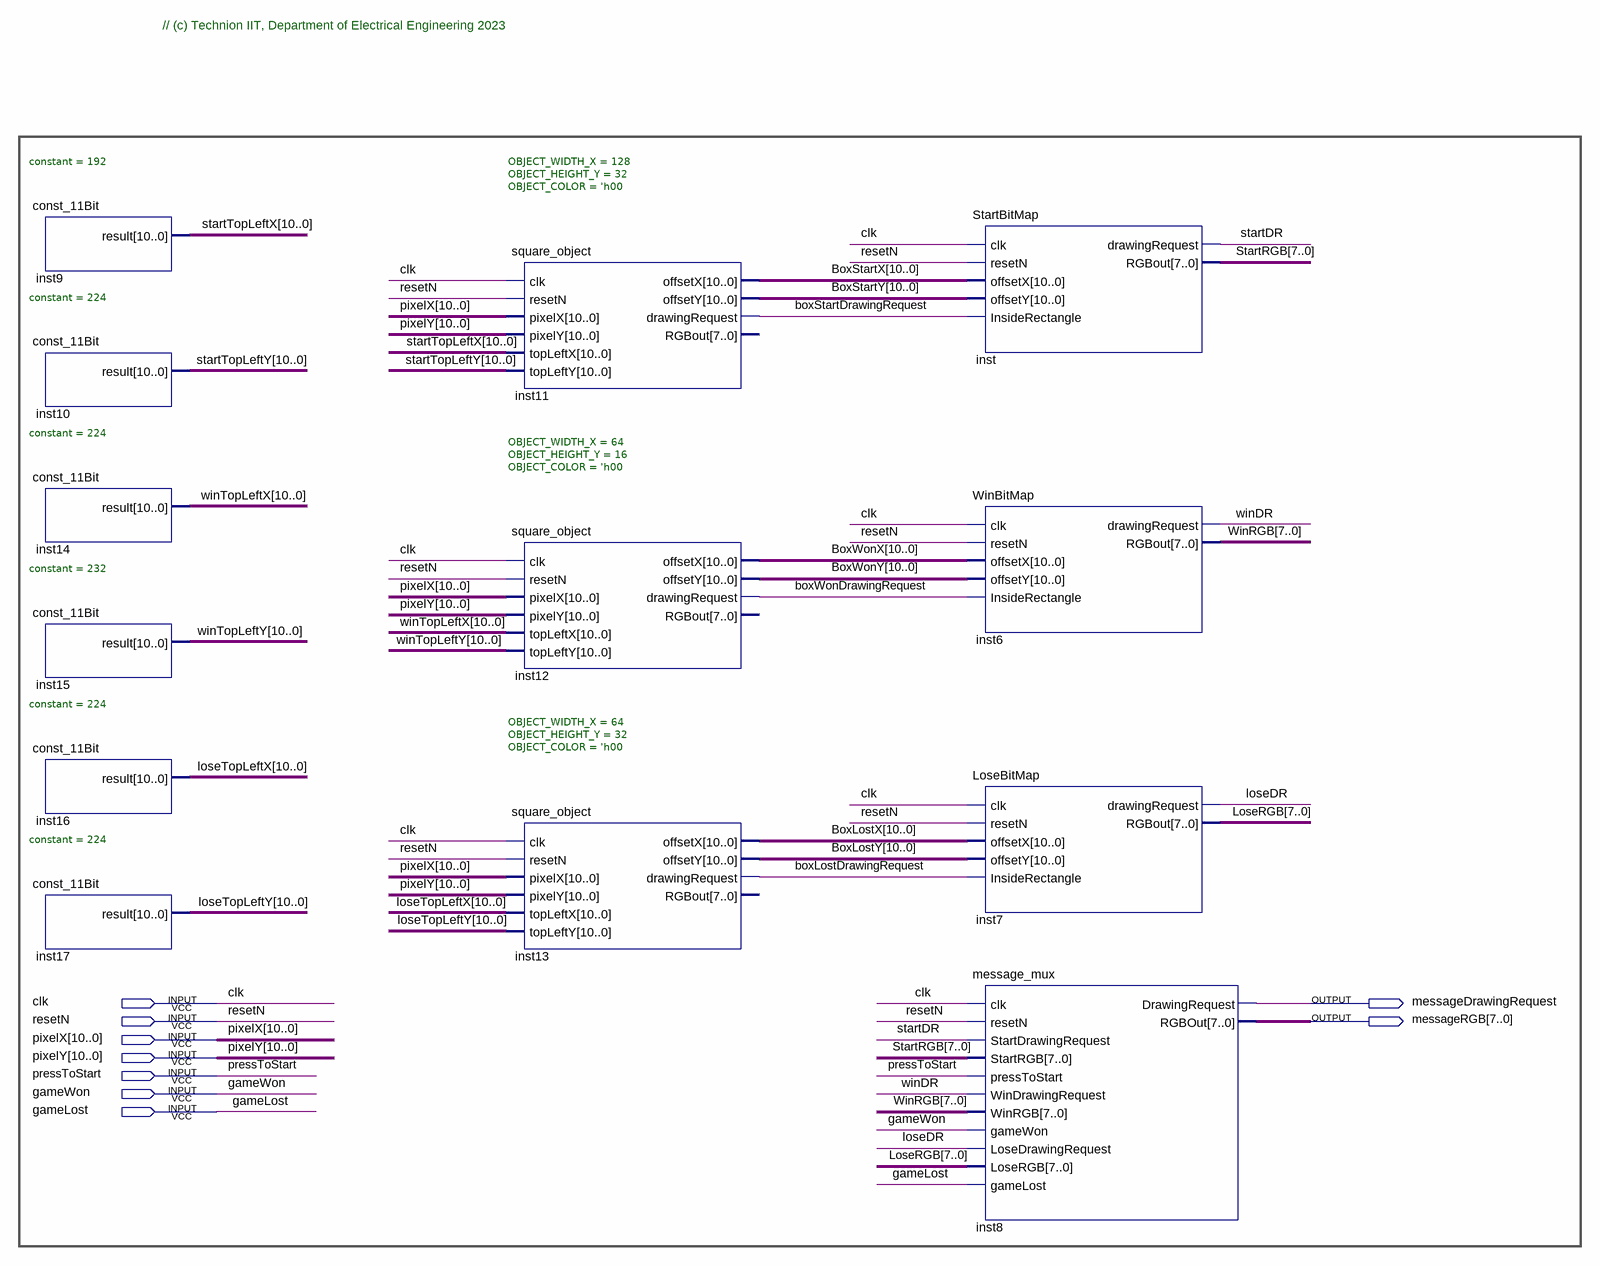
[diagram p0: schematic sheet]
// Quartus schematic MESSAGE_DISPLAY.bdf as structural Verilog: 13 symbols, 9 pins
module MESSAGE_DISPLAY (
  input  clk,
  input  resetN,
  input  [10:0] pixelX,
  input  [10:0] pixelY,
  input  pressToStart,
  input  gameWon,
  input  gameLost,
  output messageDrawingRequest,
  output [7:0] messageRGB
);

  wire boxLostDrawingRequest, boxStartDrawingRequest, boxWonDrawingRequest, loseDR, startDR, winDR;
  wire [7:0] LoseRGB, StartRGB, WinRGB;
  wire [10:0] BoxLostX, BoxLostY, BoxStartX, BoxStartY, BoxWonX, BoxWonY, loseTopLeftX, loseTopLeftY,
       startTopLeftX, startTopLeftY, winTopLeftX, winTopLeftY;

  const_11Bit #(.constant(192)) inst9 (.result(startTopLeftX));
  const_11Bit #(.constant(224)) inst10 (.result(startTopLeftY));
  const_11Bit #(.constant(224)) inst14 (.result(winTopLeftX));
  const_11Bit #(.constant(232)) inst15 (.result(winTopLeftY));
  const_11Bit #(.constant(224)) inst16 (.result(loseTopLeftX));
  const_11Bit #(.constant(224)) inst17 (.result(loseTopLeftY));
  square_object #(.OBJECT_WIDTH_X(128), .OBJECT_HEIGHT_Y(32), .OBJECT_COLOR('h00)) inst11 (
    .clk(clk), .resetN(resetN), .pixelX(pixelX), .pixelY(pixelY), .topLeftX(startTopLeftX),
    .topLeftY(startTopLeftY), .offsetX(BoxStartX), .offsetY(BoxStartY),
    .drawingRequest(boxStartDrawingRequest));  // open: RGBout
  square_object #(.OBJECT_WIDTH_X(64), .OBJECT_HEIGHT_Y(16), .OBJECT_COLOR('h00)) inst12 (
    .clk(clk), .resetN(resetN), .pixelX(pixelX), .pixelY(pixelY), .topLeftX(winTopLeftX),
    .topLeftY(winTopLeftY), .offsetX(BoxWonX), .offsetY(BoxWonY), .drawingRequest(boxWonDrawingRequest));  // open: RGBout
  square_object #(.OBJECT_WIDTH_X(64), .OBJECT_HEIGHT_Y(32), .OBJECT_COLOR('h00)) inst13 (
    .clk(clk), .resetN(resetN), .pixelX(pixelX), .pixelY(pixelY), .topLeftX(loseTopLeftX),
    .topLeftY(loseTopLeftY), .offsetX(BoxLostX), .offsetY(BoxLostY), .drawingRequest(boxLostDrawingRequest));  // open: RGBout
  StartBitMap inst (
    .clk(clk), .resetN(resetN), .offsetX(BoxStartX), .offsetY(BoxStartY),
    .InsideRectangle(boxStartDrawingRequest), .drawingRequest(startDR), .RGBout(StartRGB));
  WinBitMap inst6 (
    .clk(clk), .resetN(resetN), .offsetX(BoxWonX), .offsetY(BoxWonY), .InsideRectangle(boxWonDrawingRequest),
    .drawingRequest(winDR), .RGBout(WinRGB));
  LoseBitMap inst7 (
    .clk(clk), .resetN(resetN), .offsetX(BoxLostX), .offsetY(BoxLostY),
    .InsideRectangle(boxLostDrawingRequest), .drawingRequest(loseDR), .RGBout(LoseRGB));
  message_mux inst8 (
    .clk(clk), .resetN(resetN), .StartDrawingRequest(startDR), .StartRGB(StartRGB),
    .pressToStart(pressToStart), .WinDrawingRequest(winDR), .WinRGB(WinRGB), .gameWon(gameWon),
    .LoseDrawingRequest(loseDR), .LoseRGB(LoseRGB), .gameLost(gameLost),
    .DrawingRequest(messageDrawingRequest), .RGBOut(messageRGB));

  // Notes on the sheet:
  //   // (c) Technion IIT, Department of Electrical Engineering 2023
endmodule
